# Altium project GPSDO.PrjPCB (part 2 of 4)

## Sheet GPSDO_Controller.SchDoc: Controller
size 420 x 297 mm; EDA_Number: ARTIQ; Projet: GPSDO; Author: G.Kasprowicz; CompanyName: WUT ISE; DrawnBy: G.Kasprowicz; Organization: WUT ISE; Address1: PW ISE; Address2: Nowowiejska 15/19 00-665 Warsaw; Address3: gkasprow@gmail.com; Revision: 1; SheetNumber: -; SheetTotal: -; ModifiedBy: -; CheckedDate: -; DivGrp: WUT ISE; Designer: G.Kasprowicz; ModifiedDate: -; ProjectName: Sensor Box
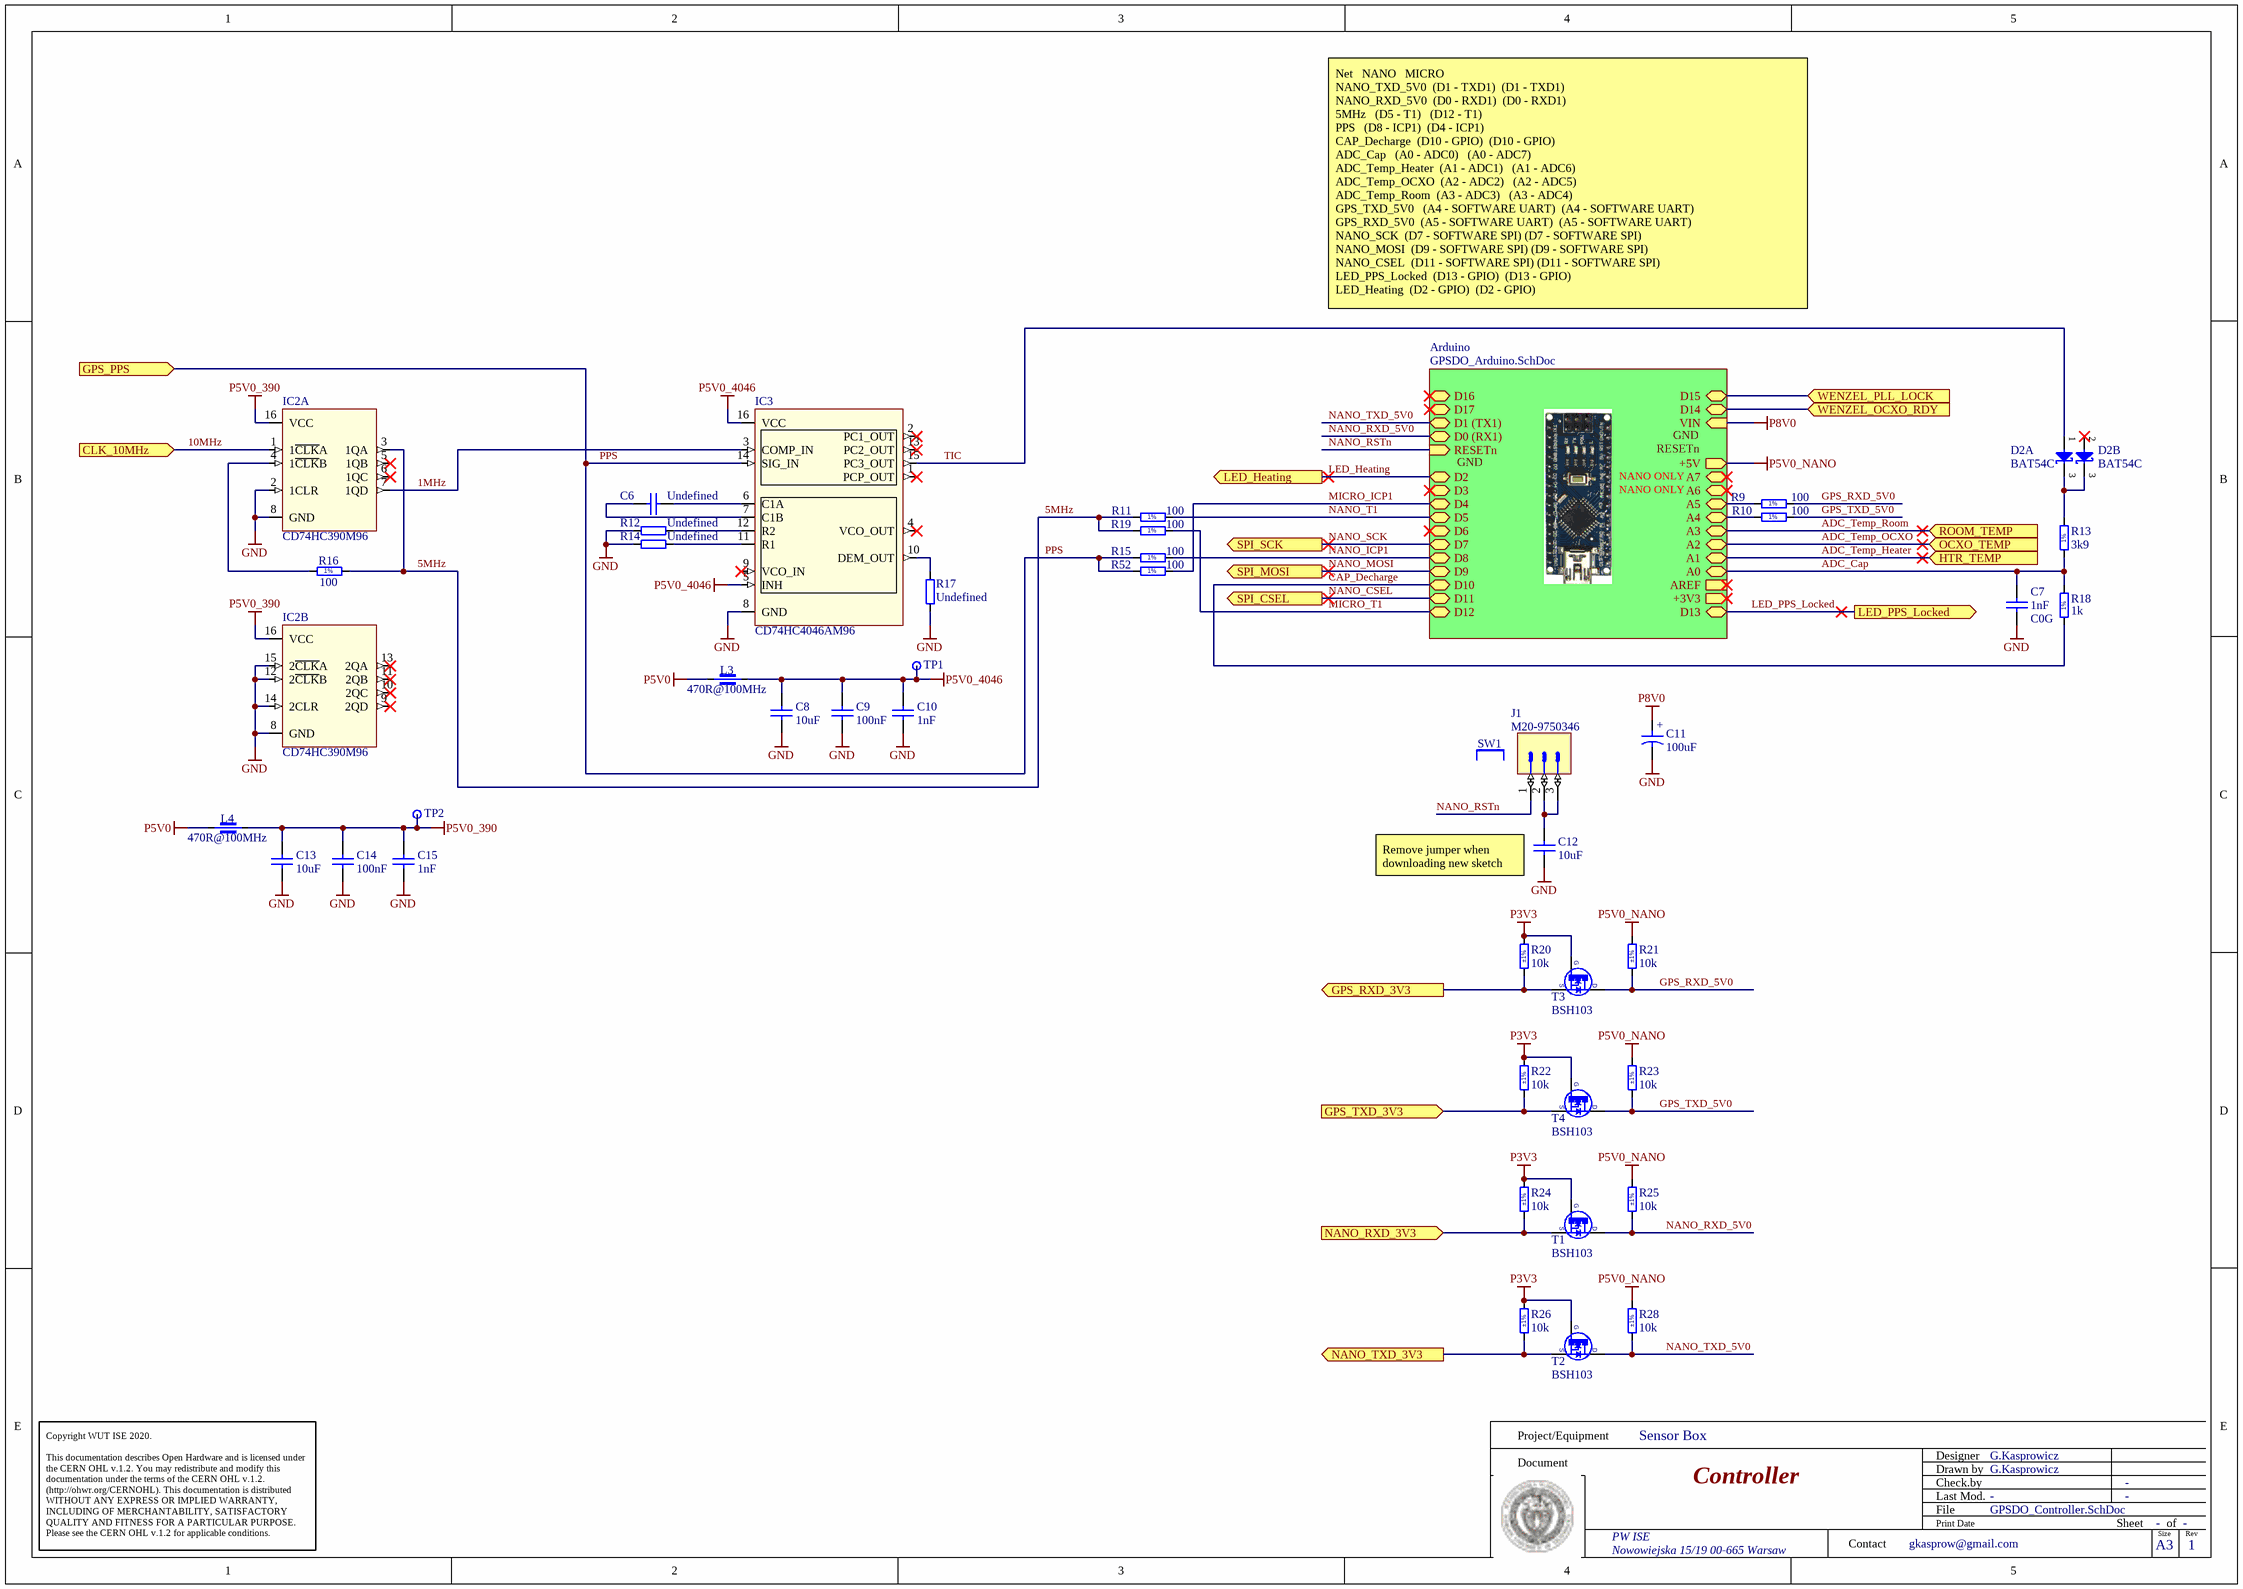
[diagram p2: GPSDO_Controller.SchDoc]

### Parts
C6  Undefined  [CAPC1005X55N]
C7  1nF  TC: C0G  [CAPC1608X90N]
C8  10uF  [CAPC1608X80N]
C9  100nF  [CAPC1005X55N]
C10  1nF  [CAPC1608X90N]
C11  100uF  [CAPMP7343X310N]
C12  10uF  [CAPC1608X80N]
C13  10uF  [CAPC1608X80N]
C14  100nF  [CAPC1005X55N]
C15  1nF  [CAPC1608X90N]
D2  BAT54C  [SOT95P240X130-3N]  (parts A,B of 2)
IC2  CD74HC390M96  [SOIC127P600X175-16N]  (parts A,B of 2)
IC3  CD74HC4046AM96  [SOIC127P600X175-16N]
J1  M20-9750346  [HARWIN_M20-9750346]
L3  470R@100MHz  [INDC1608X95N]
L4  470R@100MHz  [INDC1608X95N]
R9  100  [RESC1005X40N]
R10  100  [RESC1005X40N]
R11  100  [RESC1005X40N]
R12  Undefined  [RESC1005X40N]
R13  3k9  [RESC1005X40N]
R14  Undefined  [RESC1005X40N]
R15  100  [RESC1005X40N]
R16  100  [RESC1005X40N]
R17  Undefined  [RESC1005X40N]
R18  1k  [RESC1005X40N]
R19  100  [RESC1005X40N]
R20  10k  Tolerance: ±1%  [RESC1005X40N]
R21  10k  Tolerance: ±1%  [RESC1005X40N]
R22  10k  Tolerance: ±1%  [RESC1005X40N]
R23  10k  Tolerance: ±1%  [RESC1005X40N]
R24  10k  Tolerance: ±1%  [RESC1005X40N]
R25  10k  Tolerance: ±1%  [RESC1005X40N]
R26  10k  Tolerance: ±1%  [RESC1005X40N]
R28  10k  Tolerance: ±1%  [RESC1005X40N]
R52  100  [RESC1005X40N]
SW1  M7582-46  [HARWIN_M7582-46]  (value not drawn)
T1  BSH103  [SOT95P230X110-3N]
T2  BSH103  [SOT95P230X110-3N]
T3  BSH103  [SOT95P230X110-3N]
T4  BSH103  [SOT95P230X110-3N]
TP1  Test Point  [TPS127]  (value not drawn)  (no BOM)
TP2  Test Point  [TPS127]  (value not drawn)  (no BOM)

### Sub-sheets
Arduino = GPSDO_Arduino.SchDoc: D16 (bidir), D2 (bidir), D3 (bidir), D1 (TX1) (bidir), D17 (bidir), D7 (bidir), D8 (bidir), D9 (bidir), D14 (bidir), D11 (bidir), D0 (RX1) (bidir), D10 (bidir), D6 (bidir), D15 (bidir), D4 (bidir), D5 (bidir), D12 (bidir), A7 (bidir), D13 (bidir), +3V3 (out), +5V (out), AREF, A1 (bidir), A3 (bidir), A4 (bidir), A2 (bidir), VIN (in), RESETn (in), A6 (bidir), A5 (bidir), A0 (bidir)

### Ports
CLK_10MHz (in), GPS_PPS (in), GPS_RXD_3V3 (out), GPS_TXD_3V3 (in), HTR_TEMP (in), LED_Heating (out), LED_PPS_Locked (out), NANO_RXD_3V3 (in), NANO_TXD_3V3 (out), OCXO_TEMP (in), ROOM_TEMP (in), SPI_CSEL (out), SPI_MOSI (out), SPI_SCK (out), WENZEL_OCXO_RDY (in), WENZEL_PLL_LOCK (in)

### Nets
GND: C7.1 C8.1 C9.1 C10.1 C11.2 C12.1 C13.1 C14.1 C15.1 IC2.2(1CLR) IC2.8(GND) IC2.12(2~{CLK}B) IC2.14(2CLR) IC2.15(2~{CLK}A) IC3.8(GND) R12.1 R14.1 R17.1
P3V3: R20.2 R22.2 R24.2 R26.2 T1.1(G) T2.1(G) T3.1(G) T4.1(G)
P5V0: L3.1 L4.1
P5V0_390: C13.2 C14.2 C15.2 IC2.16(VCC) L4.2 TP2.1
P5V0_4046: C8.2 C9.2 C10.2 IC3.5(INH) IC3.16(VCC) L3.2 TP1.1
P5V0_NANO: R21.2 R23.2 R25.2 R28.2 ; sheet Arduino/+5V
P8V0: C11.1 ; sheet Arduino/VIN
1MHz: IC2.7(1QD) IC3.3(COMP_IN)
5MHz: IC2.3(1QA) R11.1 R16.2 R19.1
10MHz: IC2.1(1~{CLK}A) ; port CLK_10MHz
A4: R10.1 ; sheet Arduino/A4
A5: R9.1 ; sheet Arduino/A5
ADC_Cap: C7.2 R13.1 R18.2 ; sheet Arduino/A0  [project net A0]
ADC_Temp_Heater: port HTR_TEMP, sheet Arduino/A1  [project net A1]
ADC_Temp_OCXO: port OCXO_TEMP, sheet Arduino/A2  [project net A2]
ADC_Temp_Room: port ROOM_TEMP, sheet Arduino/A3  [project net A3]
CAP_Decharge: R18.1 ; sheet Arduino/D10
D14: port WENZEL_OCXO_RDY, sheet Arduino/D14
D15: port WENZEL_PLL_LOCK, sheet Arduino/D15
GPS_RXD_3V3: R20.1 T3.2(S) ; port GPS_RXD_3V3
GPS_RXD_5V0: R9.2 R21.1 T3.3(D)
GPS_TXD_3V3: R22.1 T4.2(S) ; port GPS_TXD_3V3
GPS_TXD_5V0: R10.2 R23.1 T4.3(D)
LED_Heating: port LED_Heating, sheet Arduino/D2  [project net D2]
LED_PPS_Locked: port LED_PPS_Locked, sheet Arduino/D13  [project net D13]
MICRO_ICP1: R52.2 ; sheet Arduino/D4  [project net D4]
MICRO_T1: R19.2 ; sheet Arduino/D12  [project net D12]
NANO_CSEL: port SPI_CSEL, sheet Arduino/D11  [project net D11]
NANO_ICP1: R15.2 ; sheet Arduino/D8  [project net D8]
NANO_MOSI: port SPI_MOSI, sheet Arduino/D9  [project net D9]
NANO_RSTn: J1.1 ; sheet Arduino/RESETn
NANO_RXD_3V3: R24.1 T1.2(S) ; port NANO_RXD_3V3
NANO_RXD_5V0: R25.1 T1.3(D) ; sheet Arduino/D0 (RX1)
NANO_SCK: port SPI_SCK, sheet Arduino/D7  [project net D7]
NANO_T1: R11.2 ; sheet Arduino/D5  [project net D5]
NANO_TXD_3V3: R26.1 T2.2(S) ; port NANO_TXD_3V3
NANO_TXD_5V0: R28.1 T2.3(D) ; sheet Arduino/D1 (TX1)
PPS: IC3.14(SIG_IN) R15.1 R52.1 ; port GPS_PPS
TIC: D2.1(A) IC3.15(PC3_OUT)
NetC6_1: C6.1 IC3.7(C1B)
NetC6_2: C6.2 IC3.6(C1A)
NetC12_2: C12.2 J1.2 J1.3
NetD2_3: D2.3(COMC) R13.2
NetIC2_4: IC2.4(1~{CLK}B) R16.1
NetIC3_10: IC3.10(DEM_OUT) R17.2
NetIC3_11: IC3.11(R1) R14.2
NetIC3_12: IC3.12(R2) R12.2

Not connected (* = marked no-connect by the designer): D2 2(A)*; IC2 5(1QB)* 6(1QC)* 9(2QD)* 10(2QC)* 11(2QB)* 13(2QA)*; IC3 1(PCP_OUT)* 2(PC1_OUT)* 4(VCO_OUT)* 9(VCO_IN)* 13(PC2_OUT)*; SW1 1

### Notes on the sheet
- Net			NANO			MICRO
  NANO_TXD_5V0		(D1 - TXD1)		(D1 - TXD1)
  NANO_RXD_5V0		(D0 - RXD1)		(D0 - RXD1)
  5MHz			(D5 - T1)			(D12 - T1)
  PPS			(D8 - ICP1)		(D4 - ICP1)
  CAP_Decharge		(D10 - GPIO)		(D10 - GPIO)
  ADC_Cap			(A0 - ADC0) 		(A0 - ADC7)
  ADC_Temp_Heater		(A1 - ADC1) 		(A1 - ADC6)
  ADC_Temp_OCXO		(A2 - ADC2) 		(A2 - ADC5)
  ADC_Temp_Room		(A3 - ADC3) 		(A3 - ADC4)
  GPS_TXD_5V0 		(A4 - SOFTWARE UART) 	(A4 - SOFTWARE UART)
  GPS_RXD_5V0		(A5 - SOFTWARE UART) 	(A5 - SOFTWARE UART)
  NANO_SCK		(D7 - SOFTWARE SPI)	(D7 - SOFTWARE SPI)
  NANO_MOSI		(D9 - SOFTWARE SPI)	(D9 - SOFTWARE SPI)
  NANO_CSEL		(D11 - SOFTWARE SPI)	(D11 - SOFTWARE SPI)
  LED_PPS_Locked		(D13 - GPIO)		(D13 - GPIO)
  LED_Heating		(D2 - GPIO)		(D2 - GPIO)
- RESETn
- GND
- NANO ONLY
- (near C12) Remove jumper when downloading new sketch
- Project/Equipment
- Document
- Designer
- Drawn by
- Check.by
- Copyright WUT ISE 2020.
  This documentation describes Open Hardware and is licensed under the CERN OHL v.1.2. You may redistribute and modify this documentation under the terms of the CERN OHL v.1.2. (http://ohwr.org/CERNOHL). This documentation is distributed WITHOUT ANY EXPRESS OR IMPLIED WARRANTY, INCLUDING OF MERCHANTABILITY, SATISFACTORY QUALITY AND FITNESS FOR A PARTICULAR PURPOSE. Please see the CERN OHL v.1.2 for applicable conditions.
- Contact
- File
- Last Mod.
- Print Date
- Sheet
- Size
- A3
- of
- Rev
- (in symbol CTE7343-31_100UF_20V_10%) +
- (in symbol R0402_1K_1%_0.0625W_100PPM) 1%
- (in symbol R0402_3K9_1%_0.0625W_100PPM) 1%
- (in symbol R0402_100R_1%_0.0625W_100PPM) 1%

### Library data of the parts
C6 = CC0402_NO-VALUE: Non-polarised capacitor; Part Description: Reserved Footprint For 0402(1005) Chip Ceramic Capacitor; Mounted: No; Part Number: CC0402_NO-VALUE; Component Kind: Standard; Component Type: Standard; Pin Count: 2; Value: Undefined; Status: None; Manufacturer: Undefined; Manufacturer Part Number: CC0402_NO-VALUE; Case: 0402; Socket: No; SMD: Yes; Sense: No; Manufacturer1 ComponentHeight: 0.55mm; HelpURL: Undefined; Author: CERN DEM JLC; CreateDate: 14.01.2014; LatestRevisionDate: 14.01.2014
C7 = CC0603_1NF_50V_1%_NP0: Non-polarised capacitor; Part Description: SMD Multilayer Chip Ceramic Capacitor; Manufacturer: GENERIC; Manufacturer1 Part Number: 06035A102FAT2A; Voltage: 50V; Tolerance: ±1%; Part Number: CC0603_1NF_50V_1%_NP0; Component Kind: Standard; Component Type: Standard; Pin Count: 2; Value: 1nF; Status: None; Manufacturer Part Number: CC0603_1NF_50V_1%_NP0; Case: 0603; Mounted: Yes; Socket: No; SMD: Yes; Sense: No; Manufacturer1 Example: AVX; Manufacturer1 ComponentHeight: 0.9mm; HelpURL: \\cern.ch\dfs\Applications\Altium\Datasheets\CC0603_C0G_AVX.pdf; Author: CERN DEM JLC; CreateDate: 15/06/2017; LatestRevisionDate: 15/06/2017
C8 C12 C13 = CC0603_10UF_10V_10%_X5R: Non-polarised capacitor; Part Description: SMD Multilayer Chip Ceramic Capacitor; Manufacturer: GENERIC; Manufacturer1 Part Number: GRM188R61A106KE69D; Voltage: 10V; TC: X5R; Tolerance: ±10%; Part Number: CC0603_10UF_10V_10%_X5R; Component Kind: Standard; Component Type: Standard; Pin Count: 2; Value: 10uF; Status: None; Manufacturer Part Number: CC0603_10UF_10V_10%_X5R; Case: 0603; Mounted: Yes; Socket: No; SMD: Yes; Sense: No; Manufacturer1 Example: MURATA; Manufacturer1 ComponentHeight: 0.8mm; HelpURL: \\cern.ch\dfs\Applications\Altium\Datasheets\CC0603_MURATA_GRM188R61A106KE69D.pdf; Author: CERN DEM JLC; CreateDate: 31.01.2017; LatestRevisionDate: 31.01.2017
C9 C14 = CC0402_100NF_16V_10%_X5R: Non-polarised capacitor; Part Description: SMD Multilayer Chip Ceramic Capacitor; Manufacturer: GENERIC; Manufacturer1 Part Number: GRM155R61C104KA88D; Voltage: 16V; TC: X5R; Tolerance: ±10%; Part Number: CC0402_100NF_16V_10%_X5R; Component Kind: Standard; Component Type: Standard; Pin Count: 2; Value: 100nF; Status: None; Manufacturer Part Number: CC0402_100NF_16V_10%_X5R; Case: 0402; Mounted: Yes; Socket: No; SMD: Yes; Sense: No; Manufacturer1 Example: MURATA; Manufacturer1 ComponentHeight: 0.55mm; HelpURL: \\cern.ch\dfs\Applications\Altium\Datasheets\CC0402_X5R_MURATA_GRM.pdf; Author: CERN DEM JLC; CreateDate: 10.12.2013; LatestRevisionDate: 10.12.2013
C10 C15 = CC0603_1NF_50V_1%_NP0: Non-polarised capacitor; Part Description: SMD Multilayer Chip Ceramic Capacitor; Manufacturer: GENERIC; Manufacturer1 Part Number: 06035A102FAT2A; Voltage: 50V; TC: C0G; Tolerance: ±1%; Part Number: CC0603_1NF_50V_1%_NP0; Component Kind: Standard; Component Type: Standard; Pin Count: 2; Value: 1nF; Status: None; Manufacturer Part Number: CC0603_1NF_50V_1%_NP0; Case: 0603; Mounted: Yes; Socket: No; SMD: Yes; Sense: No; Manufacturer1 Example: AVX; Manufacturer1 ComponentHeight: 0.9mm; HelpURL: \\cern.ch\dfs\Applications\Altium\Datasheets\CC0603_C0G_AVX.pdf; Author: CERN DEM JLC; CreateDate: 15/06/2017; LatestRevisionDate: 15/06/2017
C11 = CTE7343-31_100UF_20V_10%: Polarised capacitor; Part Description: Solid Tantalum Chip Capacitor; Manufacturer: GENERIC; Manufacturer1 Part Number: TAJD107K020R; Voltage: 20V; Tolerance: ±10%; Part Number: CTE7343-31_100UF_20V_10%; Component Kind: Standard; Component Type: Standard; Pin Count: 2; Value: 100uF; Status: Preferred; Manufacturer Part Number: CTE7343-31_100UF_20V_10%; Case: D; Mounted: Yes; Socket: No; SMD: Yes; Sense: No; Manufacturer1 Example: AVX; Manufacturer1 ComponentHeight: 3.1mm; HelpURL: \\cern.ch\dfs\Applications\Altium\Datasheets\CTE_AVX_TAJ.pdf; Author: CERN DEM JLC; CreateDate: 03/12/2007; LatestRevisionDate: 03/12/2007
D2 = BAT54C: Dual Common Cathode Schottky Diodes; Part Description: Dual Common Cathode Small Signal Schottky Diode; Manufacturer: FAIRCHILD SEMICONDUCTOR; Voltage: 30V; Power: 200mA; PressFit: No; Bonding: No; Part Number: BAT54C; Component Kind: Standard; Component Type: Standard; Device: BAT54C; PackageDescription: SOT, 0.95mm Pitch; 3 Pin, 1.30mm W X 2.90mm L X 1.30mm H, IPC Medium Density; Manufacturer Part Number: BAT54C; Pin Count: 3; Case: SOT23-3; Mounted: Yes; Socket: No; SMD: Yes; Sense: No; ComponentHeight: 1.30mm; HelpURL: \\cern.ch\dfs\Applications\Altium\Datasheets\BAT54C.pdf; Author: CERN DEM JLC; CreateDate: 17/09/2009; LatestRevisionDate: 27/05/2010
IC2 = 74HC390: Manufacturer1: Texas Instruments; Part Number: CD74HC390M96; Manufacturer1 Part Number: CD74HC390M96
IC3 = 74HC4046A: Manufacturer1: Texas Instruments; Part Number: CD74HC4046AM96; Manufacturer1 Part Number: CD74HC4046AM96
J1 = Connector 3 Male_1: Connector 3 Male 2.54mm; Manufacturer: Harwin; Manufacturer Part Number: M20-9750346; Part Number: M20-9750346
L3 L4 = IND0603_MURATA_BLM18PG471SN1D: Part Description: SMD EMIFIL Chip Ferrite Bead; Manufacturer: MURATA; Power: 1A; Resistance: 0.2R; Tolerance: ±25%; Part Number: IND0603_MURATA_BLM18PG471SN1D; Component Kind: Standard; Component Type: Standard; Pin Count: 2; Value: 470R@100MHz; Manufacturer Part Number: BLM18PG471SN1D; Case: 0603; Mounted: Yes; Socket: No; SMD: Yes; Sense: No; ComponentHeight: 0.95mm; HelpURL: \\cern.ch\dfs\Applications\Altium\Datasheets\IND0603_MURATA_BLM18P.pdf; Author: CERN DEM BC; CreateDate: 17.02.2021; LatestRevisionDate: 17.02.2021
R9-R11 R15 R16 R19 R52 = R0402_100R_1%_0.0625W_100PPM: Resistor - 1%; Part Description: General Purpose Thick Film Chip Resistor; Manufacturer: GENERIC; Manufacturer1 Part Number: 232270671001L; TC: ±100ppm/°C; PressFit: No; Part Number: R0402_100R_1%_0.0625W_100PPM; Component Kind: Standard; Component Type: Standard; Pin Count: 2; Value: 100; Status: Not Recommended; Power: 0.0625W; Tolerance: ±1%; Manufacturer Part Number: R0402_100R_1%_0.0625W_100PPM; Case: 0402; Mounted: Yes; Sense: No; Socket: No; SMD: Yes; Manufacturer1 Example: YAGEO PHYCOMP; Manufacturer1 ComponentHeight: 0.4mm; HelpURL: \\cern.ch\dfs\Applications\Altium\Datasheets\R0402_Phycomp_RC0402.pdf; Author: CERN DEM JLC; CreateDate: 03.12.2007; LatestRevisionDate: 17.10.2012
R12 R14 R17 = R0402_NO-VALUE: Resistor; Part Description: Reserved Footprint For a 0402 (1005) Chip Resistor; Mounted: No; Part Number: R0402_NO-VALUE; Component Kind: Standard; Component Type: Standard; Pin Count: 2; Value: Undefined; Status: None; Manufacturer: Undefined; Manufacturer Part Number: R0402_NO-VALUE; Case: 0402; Sense: No; Socket: No; SMD: Yes; Manufacturer1 Example: Undefined; Manufacturer1 Part Number: Undefined; Manufacturer1 ComponentHeight: Undefined; HelpURL: Undefined; Author: CERN DEM JLC; CreateDate: 03.12.2007; LatestRevisionDate: 13.03.2008
R13 = R0402_3K9_1%_0.0625W_100PPM: Resistor - 1%; Part Description: General Purpose Thick Film Chip Resistor; Manufacturer: GENERIC; Manufacturer1 Part Number: 232270673902L; TC: ±100ppm/°C; PressFit: No; Part Number: R0402_3K9_1%_0.0625W_100PPM; Component Kind: Standard; Component Type: Standard; Pin Count: 2; Value: 3k9; Status: Not Recommended; Power: 0.0625W; Tolerance: ±1%; Manufacturer Part Number: R0402_3K9_1%_0.0625W_100PPM; Case: 0402; Mounted: Yes; Sense: No; Socket: No; SMD: Yes; Manufacturer1 Example: YAGEO PHYCOMP; Manufacturer1 ComponentHeight: 0.4mm; HelpURL: \\cern.ch\dfs\Applications\Altium\Datasheets\R0402_Phycomp_RC0402.pdf; Author: CERN DEM JLC; CreateDate: 03/12/2007; LatestRevisionDate: 17/10/2012
R18 = R0402_1K_1%_0.0625W_100PPM: Resistor - 1%; Part Description: General Purpose Thick Film Chip Resistor; Manufacturer: GENERIC; Manufacturer1 Part Number: 232270671002L; TC: ±100ppm/°C; Part Number: R0402_1K_1%_0.0625W_100PPM; Component Kind: Standard; Component Type: Standard; Pin Count: 2; Value: 1k; Status: Not recommended; Power: 0.0625W; Tolerance: ±1%; Manufacturer Part Number: R0402_1K_1%_0.0625W_100PPM; Case: 0402; Mounted: Yes; Sense: No; Socket: No; SMD: Yes; Manufacturer1 Example: YAGEO PHYCOMP; Manufacturer1 ComponentHeight: 0.4mm; HelpURL: \\cern.ch\dfs\Applications\Altium\Datasheets\R0402_Phycomp_RC0402.pdf; Author: CERN DEM JLC; CreateDate: 2007-12-03; LatestRevisionDate: 2012-10-17
R20-R26 R28 = R0402_10K_1%_0.0625W_100PPM: Resistor - 1%; Part Description: General Purpose Thick Film Chip Resistor; Manufacturer: GENERIC; Manufacturer1 Part Number: 232270671003L; TC: ±100ppm/°C; PressFit: No; Part Number: R0402_10K_1%_0.0625W_100PPM; Component Kind: Standard; Component Type: Standard; Pin Count: 2; Value: 10k; Status: Not Recommended; Power: 0.0625W; Manufacturer Part Number: R0402_10K_1%_0.0625W_100PPM; Case: 0402; Mounted: Yes; Sense: No; Socket: No; SMD: Yes; Manufacturer1 Example: YAGEO PHYCOMP; Manufacturer1 ComponentHeight: 0.4mm; HelpURL: \\cern.ch\dfs\Applications\Altium\Datasheets\R0402_Phycomp_RC0402.pdf; Author: CERN DEM JLC; CreateDate: 03.12.2007; LatestRevisionDate: 17.10.2012
SW1 = HARWIN_M7582-46: Jumper 1 Pin; Manufacturer: Harwin; Manufacturer Part Number: M7582-46; Part Number: M7582-46
T1-T4 = BSH103: N-CHANNEL MOSFET WITH DIODE; Part Description: 30V 850mA N-Channel Enhancement Mode Field-Effect Transistor; Manufacturer: NEXPERIA; PressFit: No; Bonding: No; Part Number: BSH103; Component Kind: Standard; Component Type: Standard; Device: BSH103; PackageDescription: SOT23, 3 pin, Pitch 0.95mm - 1.3mm W X 2.9mm L X 1.1mm H, IPC Medium Density; Manufacturer Part Number: BSH103; Pin Count: 3; Case: SOT23-3; Mounted: Yes; Socket: No; SMD: Yes; Sense: No; ComponentHeight: 1.1mm; HelpURL: \\cern.ch\dfs\Applications\Altium\Datasheets\BSH103.pdf; Author: CERN DEM JLC; CreateDate: 16.03.2010; LatestRevisionDate: 20.06.2017
TP1 TP2 = SMD_PAD_1.27X1.27MM: Part Description: 1.27mm x 1.27mm PCB Copper Area (SMD Test Point); Mounted: No; Part Number: SMD_PAD_1.27X1.27MM; Component Type: Standard (No BOM); Pin Count: 1; Family: Test Point; Socket: No; SMD: Yes; Sense: No; Status: None; ComponentHeight: 0mm; HelpURL: Undefined; Author: CERN DEM JLC; CreateDate: 12.01.2008; LatestRevisionDate: 12.01.2008; PackageDescription: 1.27mm x 1.27mm PCB Copper Area (SMD Test Point)

## Sheet GPSDO_Arduino.SchDoc: Arduino
size 420 x 297 mm; EDA_Number: ARTIQ; Projet: GPSDO; Author: G.Kasprowicz; CompanyName: WUT ISE; DrawnBy: G.Kasprowicz; Organization: WUT ISE; Address1: PW ISE; Address2: Nowowiejska 15/19 00-665 Warsaw; Address3: gkasprow@gmail.com; Revision: 1; SheetNumber: -; SheetTotal: -; ModifiedBy: -; CheckedDate: -; DivGrp: WUT ISE; Designer: G.Kasprowicz; ModifiedDate: -; ProjectName: Sensor Box
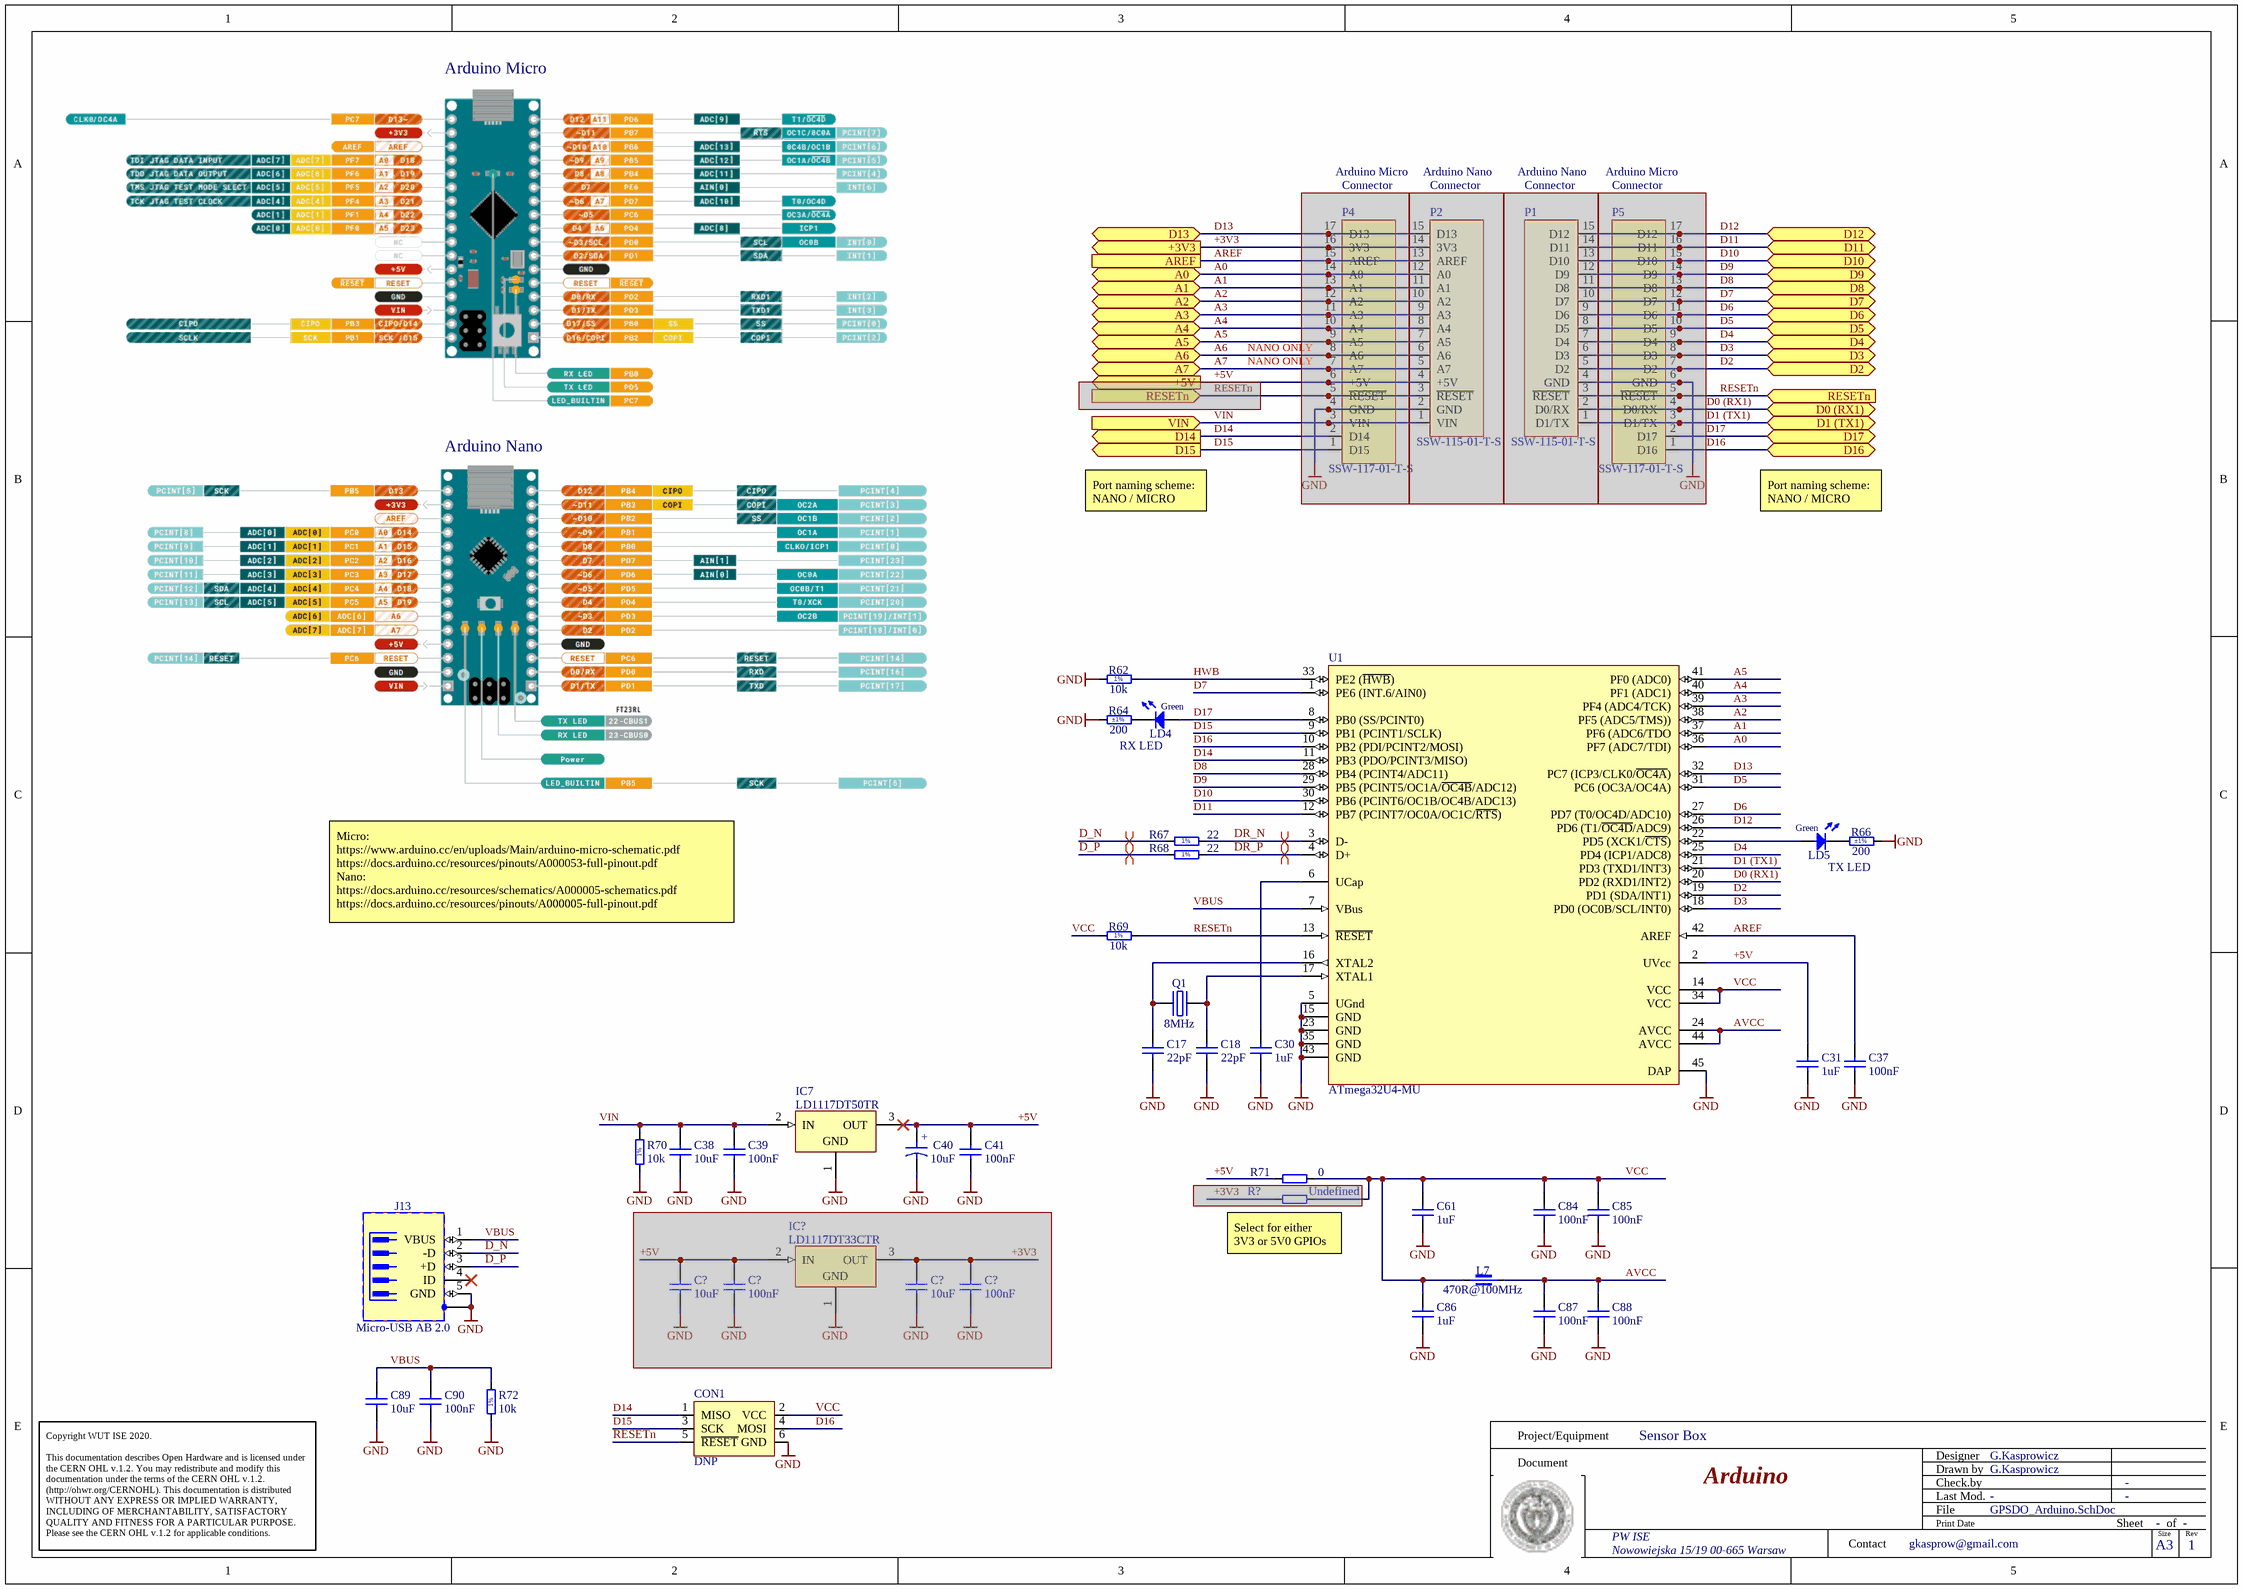
[diagram p3: GPSDO_Arduino.SchDoc]

### Parts
(Parts that share a designator on the sheet are numbered #1, #2 ... from top to bottom, then left to right.)
C17  22pF  [CAPC1005X55N]
C18  22pF  [CAPC1005X55N]
C30  1uF  [CAPC1005X55N]
C31  1uF  [CAPC1005X55N]
C37  100nF  [CAPC1005X55N]
C38  10uF  [CAPC1608X80N]
C39  100nF  [CAPC1005X55N]
C40  10uF  [CAPMP3216X180N]
C41  100nF  [CAPC1005X55N]
C61  1uF  [CAPC1005X55N]
C84  100nF  [CAPC1005X55N]
C85  100nF  [CAPC1005X55N]
C86  1uF  [CAPC1005X55N]
C87  100nF  [CAPC1005X55N]
C88  100nF  [CAPC1005X55N]
C89  10uF  [CAPC1608X80N]
C90  100nF  [CAPC1005X55N]
C?#1  100nF  [CAPC1608X87N]  (masked out: inside a compile mask, not in the netlist)
C?#2  100nF  [CAPC1608X87N]  (masked out: inside a compile mask, not in the netlist)
C?#3  10uF  [CAPC1608X80N]  (masked out: inside a compile mask, not in the netlist)
C?#4  10uF  [CAPC1608X80N]  (masked out: inside a compile mask, not in the netlist)
CON1  DNP  [HEADER3x2]
IC7  LD1117DT50TR  [TO228P972X240-3N-R540X510]
IC?  LD1117DT33CTR  [TO228P972X240-3N-R540X510]  (masked out: inside a compile mask, not in the netlist)
J13  Micro-USB AB 2.0  [HIROSE_ZX62RD-AB-5P8]
L7  470R@100MHz  [INDC1608X95N]
LD4  Green  [LED_KINGBRIGHT_KPH-1608CGCK]
LD5  Green  [LED_KINGBRIGHT_KPH-1608CGCK]
P1  SSW-115-01-T-S  [SSW-115-01-T-S]  (masked out: inside a compile mask, not in the netlist)
P2  SSW-115-01-T-S  [SSW-115-01-T-S]  (masked out: inside a compile mask, not in the netlist)
P4  SSW-117-01-T-S  [SSW-117-01-T-S]  (masked out: inside a compile mask, not in the netlist)
P5  SSW-117-01-T-S  [SSW-117-01-T-S]  (masked out: inside a compile mask, not in the netlist)
Q1  8MHz  [XTAL_TXC_7A]
R62  10k  [RESC1608X55N]
R64  200  Tolerance: ±1%  [RESC1005X40N]
R66  200  Tolerance: ±1%  [RESC1005X40N]
R67  22  [RESC1005X40N]
R68  22  [RESC1005X40N]
R69  10k  [RESC1608X55N]
R70  10k  [RESC1608X55N]
R71  0  [RESC1005X40N]
R72  10k  [RESC1608X55N]
R?  Undefined  [RESC1005X40N]  (masked out: inside a compile mask, not in the netlist)
U1  ATmega32U4-MU  [44PW_M]

### Ports
+3V3 (out), +5V (out), A0 (bidir), A1 (bidir), A2 (bidir), A3 (bidir), A4 (bidir), A5 (bidir), A6 (bidir), A7 (bidir), AREF, D0 (RX1) (bidir), D1 (TX1) (bidir), D2 (bidir), D3 (bidir), D4 (bidir), D5 (bidir), D6 (bidir), D7 (bidir), D8 (bidir), D9 (bidir), D10 (bidir), D11 (bidir), D12 (bidir), D13 (bidir), D14 (out), D15 (out), D16 (bidir), D17 (bidir), RESETn (in), VIN (in)

### Nets
GND: C17.1 C18.1 C30.1 C31.1 C37.1 C38.1 C39.1 C40.2 C41.1 C61.1 C84.1 C85.1 C86.1 C87.1 C88.1 C89.1 C90.1 CON1.6(GND) IC7.1(GND) J13.5(GND) J13.6(SH) R62.1 R64.1 R66.2 R70.1 R72.1 U1.5(UGnd) U1.15(GND) U1.23(GND) U1.35(GND) U1.43(GND) U1.45(DAP)
VIN: C38.2 C39.2 IC7.2(IN) R70.2 ; port VIN  [project net P8V0]
+3V3: port +3V3
+5V: C31.2 C40.1 C41.2 IC7.3(OUT) R71.2 U1.2(UVcc)
A0: U1.36(PF7_(ADC7/TDI)) ; port A0
A1: U1.37(PF6_(ADC6/TDO) ; port A1
A2: U1.38(PF5_(ADC5/TMS))) ; port A2
A3: U1.39(PF4_(ADC4/TCK)) ; port A3
A4: U1.40(PF1_(ADC1)) ; port A4
A5: U1.41(PF0_(ADC0)) ; port A5
A6: port A6
A7: port A7
AREF: C37.2 U1.42(AREF) ; port AREF
AVCC: C87.2 C88.2 L7.2 U1.24(AVCC) U1.44(AVCC)
D0 (RX1): U1.20(PD2_(RXD1/INT2))
D1 (TX1): U1.21(PD3_(TXD1/INT3))
D2: U1.19(PD1_(SDA/INT1)) ; port D2
D3: U1.18(PD0_(OC0B/SCL/INT0)) ; port D3
D4: U1.25(PD4_(ICP1/ADC8)) ; port D4
D5: U1.31(PC6_(OC3A/OC4A)) ; port D5
D6: U1.27(PD7_(T0/OC4D/ADC10)) ; port D6
D7: U1.1(PE6_(INT.6/AIN0)) ; port D7
D8: U1.28(PB4_(PCINT4/ADC11)) ; port D8
D9: U1.29(PB5_(PCINT5/OC1A/~{OC4B}/ADC12)) ; port D9
D10: U1.30(PB6_(PCINT6/OC1B/OC4B/ADC13)) ; port D10  [project net CAP_Decharge]
D11: U1.12(PB7_(PCINT7/OC0A/OC1C/~{RTS})) ; port D11
D12: U1.26(PD6_(T1/~{OC4D}/ADC9)) ; port D12
D13: U1.32(PC7_(ICP3/CLK0/~{OC4A})) ; port D13
D14: CON1.1(MISO) U1.11(PB3_(PDO/PCINT3/MISO)) ; port D14
D15: CON1.3(SCK) U1.9(PB1_(PCINT1/SCLK)) ; port D15
D16: CON1.4(MOSI) U1.10(PB2_(PDI/PCINT2/MOSI))
D17: LD4.2(A) U1.8(PB0_(SS/PCINT0))
D_N: J13.2(-D) R67.1
D_P: J13.3(+D) R68.1
DR_N: R67.2 U1.3(D-)
DR_P: R68.2 U1.4(D+)
HWB: R62.2 U1.33(PE2_(~{HWB}))
RESETn: CON1.5(~{RESET}) R69.2 U1.13(~{RESET}) ; port RESETn  [project net NANO_RSTn]
VBUS: C89.2 C90.2 J13.1(VBUS) R72.2 U1.7(VBus)
VCC: C61.2 C84.2 C85.2 C86.2 CON1.2(VCC) L7.1 R69.1 R71.1 U1.14(VCC) U1.34(VCC)
NetC17_2: C17.2 Q1.1(OSC1) U1.16(XTAL2)
NetC18_2: C18.2 Q1.2(OSC2) U1.17(XTAL1)
NetC30_2: C30.2 U1.6(UCap)
NetLD4_1: LD4.1(C) R64.2
NetLD5_1: LD5.1(C) R66.1
NetLD5_2: LD5.2(A) U1.22(PD5_(XCK1/~{CTS}))

Not connected (* = marked no-connect by the designer): J13 4(ID)*

### Layout directives
differential pair: D_N, D_P, DR_N, DR_P

### Notes on the sheet
- Arduino Micro
- Connector
- Arduino Nano
- (near P2) Connector
- (near P1) Connector
- (near P4) NANO ONLY
- Port naming scheme:
  NANO / MICRO
- RX LED
- Micro:
  https://www.arduino.cc/en/uploads/Main/arduino-micro-schematic.pdf
  https://docs.arduino.cc/resources/pinouts/A000053-full-pinout.pdf
  Nano:
  https://docs.arduino.cc/resources/schematics/A000005-schematics.pdf
  https://docs.arduino.cc/resources/pinouts/A000005-full-pinout.pdf
- TX LED
- (near R?) Select for either 3V3 or 5V0 GPIOs
- Project/Equipment
- Document
- Designer
- Drawn by
- Check.by
- Copyright WUT ISE 2020.
  This documentation describes Open Hardware and is licensed under the CERN OHL v.1.2. You may redistribute and modify this documentation under the terms of the CERN OHL v.1.2. (http://ohwr.org/CERNOHL). This documentation is distributed WITHOUT ANY EXPRESS OR IMPLIED WARRANTY, INCLUDING OF MERCHANTABILITY, SATISFACTORY QUALITY AND FITNESS FOR A PARTICULAR PURPOSE. Please see the CERN OHL v.1.2 for applicable conditions.
- Contact
- File
- Last Mod.
- Print Date
- Sheet
- Size
- A3
- of
- Rev
- (in symbol CTE3216-18_10UF_16V_20%_AVX_TCJ) +
- (in symbol R0402_22R_1%_0.0625W_100PPM) 1%
- (in symbol R0603_10K_1%_0.1W_100PPM) 1%

### Library data of the parts
C17 C18 = CC0402_22PF_50V_5%_C0G: Non-polarised capacitor; Part Description: SMD Multilayer Chip Ceramic Capacitor; Manufacturer: GENERIC; Manufacturer1 Part Number: C0402C220J5GACTU; Voltage: 50V; TC: C0G/NP0; Tolerance: ±5%; Part Number: CC0402_22PF_50V_5%_C0G; Component Kind: Standard; Component Type: Standard; Pin Count: 2; Value: 22pF; Status: Preferred; Manufacturer Part Number: CC0402_22PF_50V_5%_C0G; Case: 0402; Mounted: Yes; Socket: No; SMD: Yes; Manufacturer1 Example: KEMET; Manufacturer1 ComponentHeight: 0.55mm; HelpURL: \\cern.ch\dfs\Applications\Altium\Datasheets\CC0402_C0G_KEMET_(Commercial Grade).pdf; Author: CERN DEM JLC; CreateDate: 2007-12-03; LatestRevisionDate: 2007-12-03; Sense: No
C30 C31 C61 C86 = CC0402_1UF_16V_10%_X5R: Non-polarised capacitor; Part Description: SMD Multilayer Chip Ceramic Capacitor; Manufacturer: GENERIC; Manufacturer1 Part Number: C1005X5R1C105KT; Voltage: 16V; TC: X5R; Tolerance: ±10%; Part Number: CC0402_1UF_16V_10%_X5R; Component Kind: Standard; Component Type: Standard; Pin Count: 2; Value: 1uF; Status: Preferred; Manufacturer Part Number: CC0402_1UF_16V_10%_X5R; Case: 0402; Mounted: Yes; Socket: No; SMD: Yes; Sense: No; Manufacturer1 Example: TDK; Manufacturer1 ComponentHeight: 0.55mm; HelpURL: \\cern.ch\dfs\Applications\Altium\Datasheets\CC0402_X5R_TDK_C.pdf; Author: CERN DEM JLC; CreateDate: 25.10.2012; LatestRevisionDate: 25.10.2012
C37 C39 C41 C84 C85 C87 C88 C90 = CC0402_100NF_16V_10%_X5R: as C9 on sheet GPSDO_Controller; Part Number: CC0402_100NF_16V_10%_X5R; Component Kind: Standard; Component Type: Standard; Pin Count: 2; Value: 100nF; Status: None; Manufacturer Part Number: CC0402_100NF_16V_10%_X5R; Case: 0402; Mounted: Yes; Socket: No; SMD: Yes; Sense: No; Manufacturer1 Example: MURATA; Manufacturer1 ComponentHeight: 0.55mm; HelpURL: \\cern.ch\dfs\Applications\Altium\Datasheets\CC0402_X5R_MURATA_GRM.pdf; Author: CERN DEM JLC; CreateDate: 10.12.2013; LatestRevisionDate: 10.12.2013
C38 C89 C?#3 C?#4 = CC0603_10UF_10V_10%_X5R: as C8 on sheet GPSDO_Controller; Part Number: CC0603_10UF_10V_10%_X5R; Component Kind: Standard; Component Type: Standard; Pin Count: 2; Value: 10uF; Status: None; Manufacturer Part Number: CC0603_10UF_10V_10%_X5R; Case: 0603; Mounted: Yes; Socket: No; SMD: Yes; Sense: No; Manufacturer1 Example: MURATA; Manufacturer1 ComponentHeight: 0.8mm; HelpURL: \\cern.ch\dfs\Applications\Altium\Datasheets\CC0603_MURATA_GRM188R61A106KE69D.pdf; Author: CERN DEM JLC; CreateDate: 31.01.2017; LatestRevisionDate: 31.01.2017
C40 = CTE3216-18_10UF_16V_20%_AVX_TCJ: Polarised capacitor; Part Description: ESR 0R200 Tantalum Solid Electrolytic Chip Capacitor with Conductive Polymer Electrode; Manufacturer: AVX; Manufacturer Part Number: TCJA106M016R0200 or  or TR3A106K016C1700; Voltage: 16V; Tolerance: ±20%; Part Number: CTE3216-18_10UF_16V_20%_AVX_TCJ; Component Kind: Standard; Component Type: Standard; Pin Count: 2; Value: 10uF; Status: Preferred; Case: A; Mounted: Yes; Socket: No; SMD: Yes; Sense: No; ComponentHeight: 1.8mm; HelpURL: \\cern.ch\dfs\Applications\Altium\Datasheets\CTE_AVX_TCJ.pdf; Author: CERN DEM JLC; CreateDate: 29.03.2012; LatestRevisionDate: 29.03.2012
C?#1 C?#2 = CC0603_100NF_50V_10%_X5R: Non-polarised capacitor; Part Description: SMD Multilayer Chip Ceramic Capacitor; Manufacturer: GENERIC; Manufacturer1 Part Number: C1608X5R1H104K080AA; Voltage: 50V; TC: X5R; Tolerance: ±10%; Part Number: CC0603_100NF_50V_10%_X5R; Component Kind: Standard; Component Type: Standard; Pin Count: 2; Value: 100nF; Status: None; Manufacturer Part Number: CC0603_100NF_50V_10%_X5R; Case: 0603; Mounted: Yes; Socket: No; SMD: Yes; Sense: No; Manufacturer1 Example: TDK; Manufacturer1 ComponentHeight: 0.9mm; HelpURL: \\cern.ch\dfs\Applications\Altium\Datasheets\CC0603_X5R_TDK_C.pdf; Author: CERN DEM MR; CreateDate: 08.01.2016; LatestRevisionDate: 08.01.2016
CON1 = CON_ISP: 6x 2.54mm SMT  dual row pin header
IC7 = LD1117DT50TR: 3-Terminal Regulator 1=GND 2=IN 3=OUT; Part Description: 5V 800mA Low drop fixed positive voltage regulators; Manufacturer: ST MICROELECTRONICS; PressFit: No; Bonding: No; Part Number: LD1117DT50TR; Component Kind: Standard; Component Type: Standard; Device: LD1117DT50TR; PackageDescription: TO-252 DPAK TO, 2.28mm Pitch; 2 Pin, 9.725mm L X 6.10mm W X 2.40mm H body, IPC Medium Density; Manufacturer Part Number: LD1117DT50TR; Pin Count: 3; Case: DPAK; Mounted: Yes; Socket: No; SMD: Yes; Sense: No; ComponentHeight: 2.4mm; HelpURL: \\cern.ch\dfs\Applications\Altium\Datasheets\LD1117DT50TR.pdf; Author: CERN DEM JLC; CreateDate: 20/09/2010; LatestRevisionDate: 20/09/2010
IC? = LD1117DT33CTR: 3-Terminal Regulator 1=GND 2=IN 3=OUT; Part Description: 3.3V 800mA Low drop fixed and adjustable positive voltage regulators; Manufacturer: ST MICROELECTRONICS; PressFit: No; Bonding: No; Part Number: LD1117DT33CTR; Component Kind: Standard; Component Type: Standard; Device: LD1117DT33CTR; PackageDescription: DPAK TO-252, 2.28mm pitch; 2 pin, 9.725mm L X 6.10mm W X 2.40mm H body, IPC Medium Density; Manufacturer Part Number: LD1117DT33CTR; Pin Count: 3; Case: DPAK; Mounted: Yes; Socket: No; SMD: Yes; Sense: No; ComponentHeight: 2.4mm; HelpURL: \\cern.ch\dfs\Applications\Altium\Datasheets\LD1117DT33CTR.pdf; Author: CERN DEM JLC; CreateDate: 08.06.2011; LatestRevisionDate: 08.06.2011
J13 = HIROSE_ZX62RD-AB-5P8: 5 Pin + 1 Shield USB Receptacle; Part Description: Micro-USB 2.0 Right Angle, SMD Type AB - Reverse (Top mount), Shell Through Hole; Manufacturer: HIROSE (HRS); PressFit: No; Part Number: HIROSE_ZX62RD-AB-5P8; Component Kind: Standard; Component Type: Standard; Pin Count: 7; Family: Micro-USB AB 2.0; Mounted: Yes; Socket: No; SMD: Yes; Sense: No; Status: None; Manufacturer Part Number: ZX62RD-AB-5P8; ComponentHeight: 2.35mm; HelpURL: \\cern.ch\dfs\Applications\Altium\Datasheets\HIROSE_ZX62RD-AB-5P8.pdf; ComponentLink1URL: \\cern.ch\dfs\Applications\Altium\Datasheets\HIROSE_ZX62RD-AB-5P8_Package-Drawing.pdf; ComponentLink1Description: Package-Drawing; Author: CERN DEM JLC; CreateDate: 29.10.2014; LatestRevisionDate: 29.10.2014; ClassName: Connectors
L7 = IND0603_MURATA_BLM18PG471SN1D: as L3 on sheet GPSDO_Controller; Part Number: IND0603_MURATA_BLM18PG471SN1D; Component Kind: Standard; Component Type: Standard; Pin Count: 2; Value: 470R@100MHz; Manufacturer Part Number: BLM18PG471SN1D; Case: 0603; Mounted: Yes; Socket: No; SMD: Yes; Sense: No; ComponentHeight: 0.95mm; HelpURL: \\cern.ch\dfs\Applications\Altium\Datasheets\IND0603_MURATA_BLM18P.pdf; Author: CERN DEM BC; CreateDate: 17.02.2021; LatestRevisionDate: 17.02.2021
LD4 LD5 = LED_KINGBRIGHT_KPH-1608CGCK: LED Green 1C 2A; Part Description: SMD Green LED, Case 1.6mmX0.8mm(0603), 0.65mm Thickness; PressFit: No; Bonding: No; Part Number: LED_KINGBRIGHT_KPH-1608CGCK; Component Kind: Standard; Component Type: Standard; Color: Green; PackageDescription: SMT Green LED, Case 0603, Body L 1.6 x W 0.8mm H 0.65mm; Manufacturer: KINGBRIGHT; Manufacturer Part Number: KPH-1608CGCK; Pin Count: 2; Mounted: Yes; Socket: No; SMD: Yes; Sense: No; ComponentHeight: 0.65mm; HelpURL: \\cern.ch\dfs\Applications\Altium\Datasheets\LED_KINGBRIGHT_KPH-1608CGCK.pdf; Author: CERN DEM JLC; CreateDate: 03.07.2017; LatestRevisionDate: 03.07.2017
P1 = Arduino_Nano_Socket_A: Manufacturer1: Samtec; Part Number: SSW-115-01-T-S; Manufacturer1 Part Number: SSW-115-01-T-S
P2 = Arduino_Nano_Socket_B: Manufacturer1: Samtec; Part Number: SSW-115-01-T-S; Manufacturer1 Part Number: SSW-115-01-T-S
P4 = Arduino_Micro_Socket_B: Manufacturer1: Samtec; Part Number: SSW-117-01-T-S; Manufacturer1 Part Number: SSW-117-01-T-S
P5 = Arduino_Micro_Socket_A: Manufacturer1: Samtec; Part Number: SSW-117-01-T-S; Manufacturer1 Part Number: SSW-117-01-T-S
Q1 = XTAL_8MHZ_TXC_7A-8.000MAAE-T: Quartz Crystal; Part Description: Tolerance: ±30ppm, Stability: ±30ppm, -20°C to +70°C, 12pF, SMD Glass Seam Sealing Crystal, 7A Series; Manufacturer: TXC CORPORATION; PressFit: No; Bonding: No; Part Number: XTAL_8MHZ_TXC_7A-8.000MAAE-T; Component Kind: Standard; Component Type: Standard; PackageDescription: 2 Pins, 3.2x5mm, SMD Glass Seam Sealing Crystal, 7A Serie; Value: 8MHz; Manufacturer Part Number: 7A-8.000MAAE-T; Pin Count: 2; Mounted: Yes; Socket: No; SMD: Yes; Sense: No; ComponentHeight: 1.2mm; HelpURL: \\cern.ch\dfs\Applications\Altium\Datasheets\XTAL_TXC_7A.pdf; Author: CERN DEM JLC; CreateDate: 09.10.2014; LatestRevisionDate: 12.11.2014
R62 R69 R70 R72 = R0603_10K_1%_0.1W_100PPM: Resistor - 1%; Part Description: General Purpose Thick Film Chip Resistor; Manufacturer: GENERIC; Manufacturer1 Part Number: NRC06F1002TRF; Power: 0.1W; TC: ±100ppm/°C; PressFit: No; Part Number: R0603_10K_1%_0.1W_100PPM; Component Kind: Standard; Component Type: Standard; Pin Count: 2; Value: 10k; Status: Preferred; Tolerance: ±1%; Manufacturer Part Number: R0603_10K_1%_0.1W_100PPM; Case: 0603; Mounted: Yes; Sense: No; Socket: No; SMD: Yes; Manufacturer1 Example: NIC COMPONENT; Manufacturer1 ComponentHeight: 0.55mm; HelpURL: \\cern.ch\dfs\Applications\Altium\Datasheets\R0603_NIC_NRC.pdf; Author: CERN DEM JLC; CreateDate: 03.12.2007; LatestRevisionDate: 13.03.2008
R64 R66 = R0402_200R_1%_0.0625W_100PPM: Resistor - 1%; Part Description: General Purpose Thick Film Chip Resistor; Manufacturer: GENERIC; Manufacturer1 Part Number: 232270672001L; TC: ±100ppm/°C; PressFit: No; Part Number: R0402_200R_1%_0.0625W_100PPM; Component Kind: Standard; Component Type: Standard; Pin Count: 2; Value: 200; Status: Not Recommended; Power: 0.0625W; Manufacturer Part Number: R0402_200R_1%_0.0625W_100PPM; Case: 0402; Mounted: Yes; Sense: No; Socket: No; SMD: Yes; Manufacturer1 Example: YAGEO PHYCOMP; Manufacturer1 ComponentHeight: 0.4mm; HelpURL: \\cern.ch\dfs\Applications\Altium\Datasheets\R0402_Phycomp_RC0402.pdf; Author: CERN DEM JLC; CreateDate: 03.12.2007; LatestRevisionDate: 17.10.2012
R67 R68 = R0402_22R_1%_0.0625W_100PPM: Resistor - 1%; Part Description: General Purpose Thick Film Chip Resistor; Manufacturer: GENERIC; Manufacturer1 Part Number: 232270672209L; PressFit: No; Part Number: R0402_22R_1%_0.0625W_100PPM; Component Kind: Standard; Component Type: Standard; Pin Count: 2; Value: 22; Status: Not Recommended; Power: 0.0625W; Tolerance: ±1%; Manufacturer Part Number: R0402_22R_1%_0.0625W_100PPM; Case: 0402; Mounted: Yes; Socket: No; SMD: Yes; Manufacturer1 Example: YAGEO PHYCOMP; Manufacturer1 ComponentHeight: 0.4mm; HelpURL: \\cern.ch\dfs\Applications\Altium\Datasheets\R0402_Phycomp_RC0402.pdf; Author: CERN DEM JLC; CreateDate: 03.12.2007; LatestRevisionDate: 17.10.2012; Sense: No
R71 = R0402_0R_JUMPER: Resistor; Part Description: 1A (0.05R Max DC Resistance) Zero Ohm Jumper; Manufacturer: GENERIC; Manufacturer1 Part Number: 232270591001L; PressFit: No; Part Number: R0402_0R_JUMPER; Component Kind: Standard; Component Type: Standard; Pin Count: 2; Value: 0; Status: Not Recommended; Manufacturer Part Number: R0402_0R_JUMPER; Case: 0402; Mounted: Yes; Socket: No; SMD: Yes; Manufacturer1 Example: YAGEO PHYCOMP; Manufacturer1 ComponentHeight: 0.4mm; HelpURL: \\cern.ch\dfs\Applications\Altium\Datasheets\R0402_Phycomp_RC0402.pdf; Author: CERN DEM JLC; CreateDate: 03.12.2007; LatestRevisionDate: 17.10.2012; Sense: No
R? = R0402_NO-VALUE: as R12 on sheet GPSDO_Controller; Part Number: R0402_NO-VALUE; Component Kind: Standard; Component Type: Standard; Pin Count: 2; Value: Undefined; Status: None; Manufacturer: Undefined; Manufacturer Part Number: R0402_NO-VALUE; Case: 0402; Sense: No; Socket: No; SMD: Yes; Manufacturer1 Example: Undefined; Manufacturer1 Part Number: Undefined; Manufacturer1 ComponentHeight: Undefined; HelpURL: Undefined; Author: CERN DEM JLC; CreateDate: 03.12.2007; LatestRevisionDate: 13.03.2008
U1 = CMP-0095-00166-2: 8-bit AVR Microcontroller, 2.7-5.5V, 16MHz, 32KB Flash, 1KB EEPROM, 2.5KB SRAM, USB Controller, 44-pin QFN, Industrial Grade (-40°C to 85°C), Ext Osc; PackageVersion: revG, Sep-2009; PackageReference: 44PW; ComponentLink1URL: http://www.atmel.com/; PackageDescription: 44-Pin Quad Flat No-Lead Package, 7 x 7 mm Body, 0.5 mm Pitch (QFN); ComponentLink3Description: ATmega16U4 ATmega32U4 Summary; RevisionNote: DatasheetVersion, PackageVersion & PCB updated. URLs added.; ComponentLink2Description: ATmega16U4/32U4 Datasheet; ComponentLink1Description: Manufacturer URL; ComponentLink3URL: http://www.atmel.com/dyn/resources/prod_documents/7766S.pdf; DatasheetVersion: revF, Nov-2010; ComponentLink2URL: http://www.atmel.com/dyn/resources/prod_documents/doc7766.pdf; Code_JEDEC: MO-220-VKKD-1; Part Number: ATmega32U4-MU